# EAGLE design MQ303A + EEPROM v4.0 - para testes (EAGLE 9.6.2)
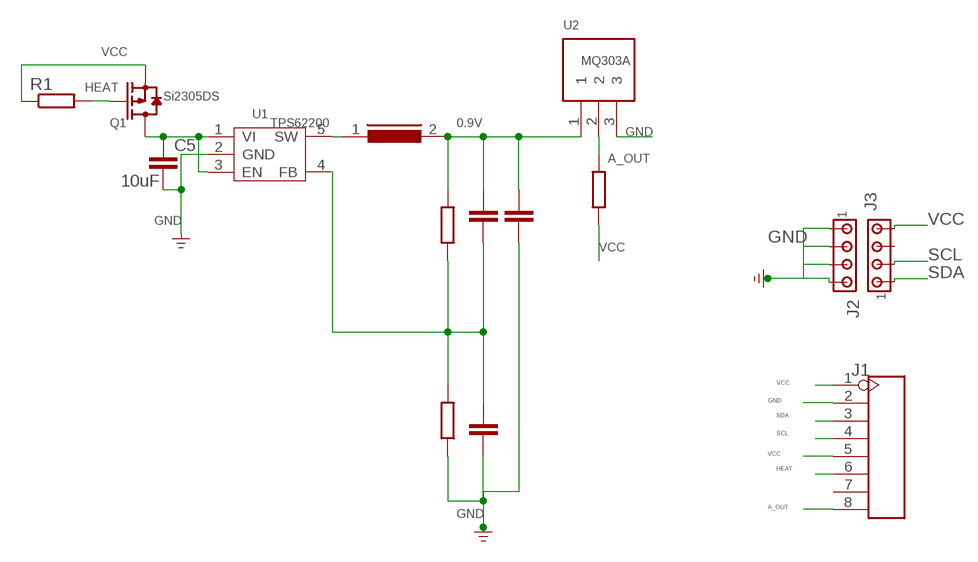
[diagram p0: schematic, sheet 1]

## Parts
C1  10uF  C-EU050-025X075  [C050-025X075]
C2  10uF  C-EU050-025X075  [C050-025X075]
C3  10uF  C-EU050-025X075  [C050-025X075]
C5  10uF  C-EU050-025X075  [C050-025X075]
J1  HEADER-8P-2.54  [8P-2.54]
J2  MTA04-100  [10X04MTA]
J3  MTA04-100  [10X04MTA]
L2  MMICC7  [MMICC7]
Q1  Si2305DS  MOSFET-P'SI2323CDS/SI2305DS<BR>'  [SOT23]
R1  R-EU_0207/10  [0207/10]
R2  R-EU_0207/10  [0207/10]
R3  R-EU_0207/10  [0207/10]
R5  R-EU_0207/10  [0207/10]
U1  TPS62200  TPS62200DBV  [SOT23-5]
U2  MQ303A  [MQ303A]

## Nets
0.9V: C1.1 C3.1 L2.2 R5.2 U2.1
A_OUT: J1.8 R3.2 U2.2
GND: C2.2 C3.2 C5.2 J1.2 J2.1 J2.2 J2.3 J2.4 R2.1 U1.2(GND) U2.3
HEAT: J1.6 Q1.1(G) R1.2
N$1: C5.1 Q1.3(D) U1.1(VI) U1.3(EN)
N$2: L2.1 U1.5(SW)
N$3: C1.2 C2.1 R2.2 R5.1 U1.4(FB)
SCL: J1.4 J3.2
SDA: J1.3 J3.1
VCC: J1.1 J1.5 J3.4 Q1.2(S) R1.1 R3.1
Unconnected: J1.7 J3.3

## Library data of the parts
C1-C3 C5 = rcl:C-EU: CAPACITOR, European symbol; SPICEPREFIX: C
J1 = Connector:HEADER-8P
J2 J3 = con-amp:MTA04-100: AMP connector
L2 = inductors:MMICC7: INDUCTOR; SPICEPREFIX: L
Q1 = Discrete:MOSFET-P
R1-R3 R5 = rcl:R-EU_: RESISTOR, European symbol; SPICEPREFIX: R
U1 = IC:TPS62200: High-Efficiency,SOT23 STEP-DOWN,DC-DC Converter
U2 = MQ303A:MQ303A

## Board
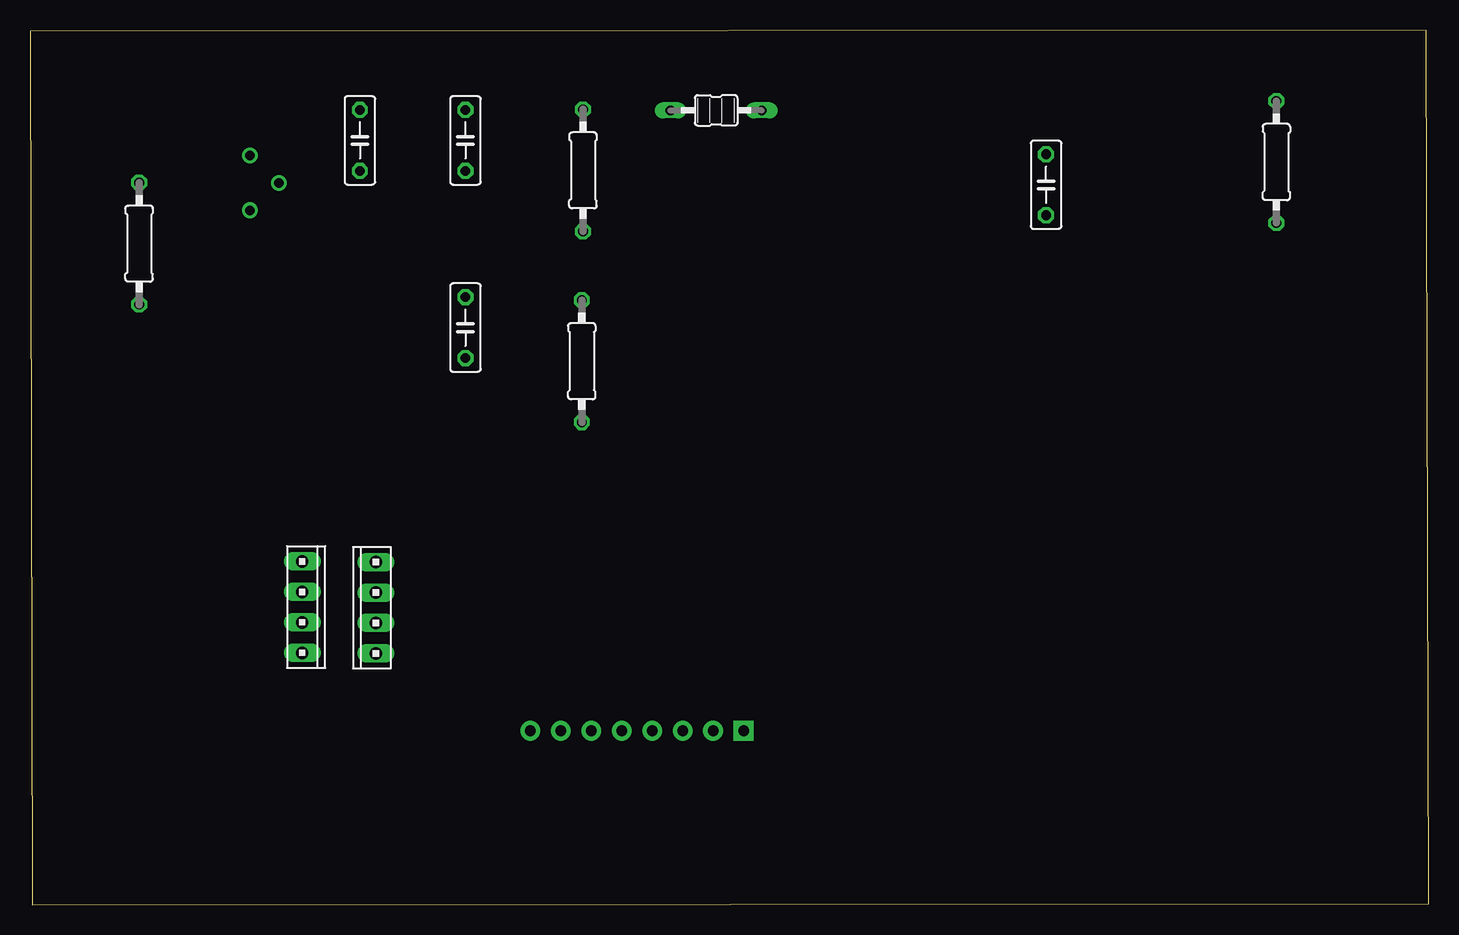
[diagram p1: board, top side]
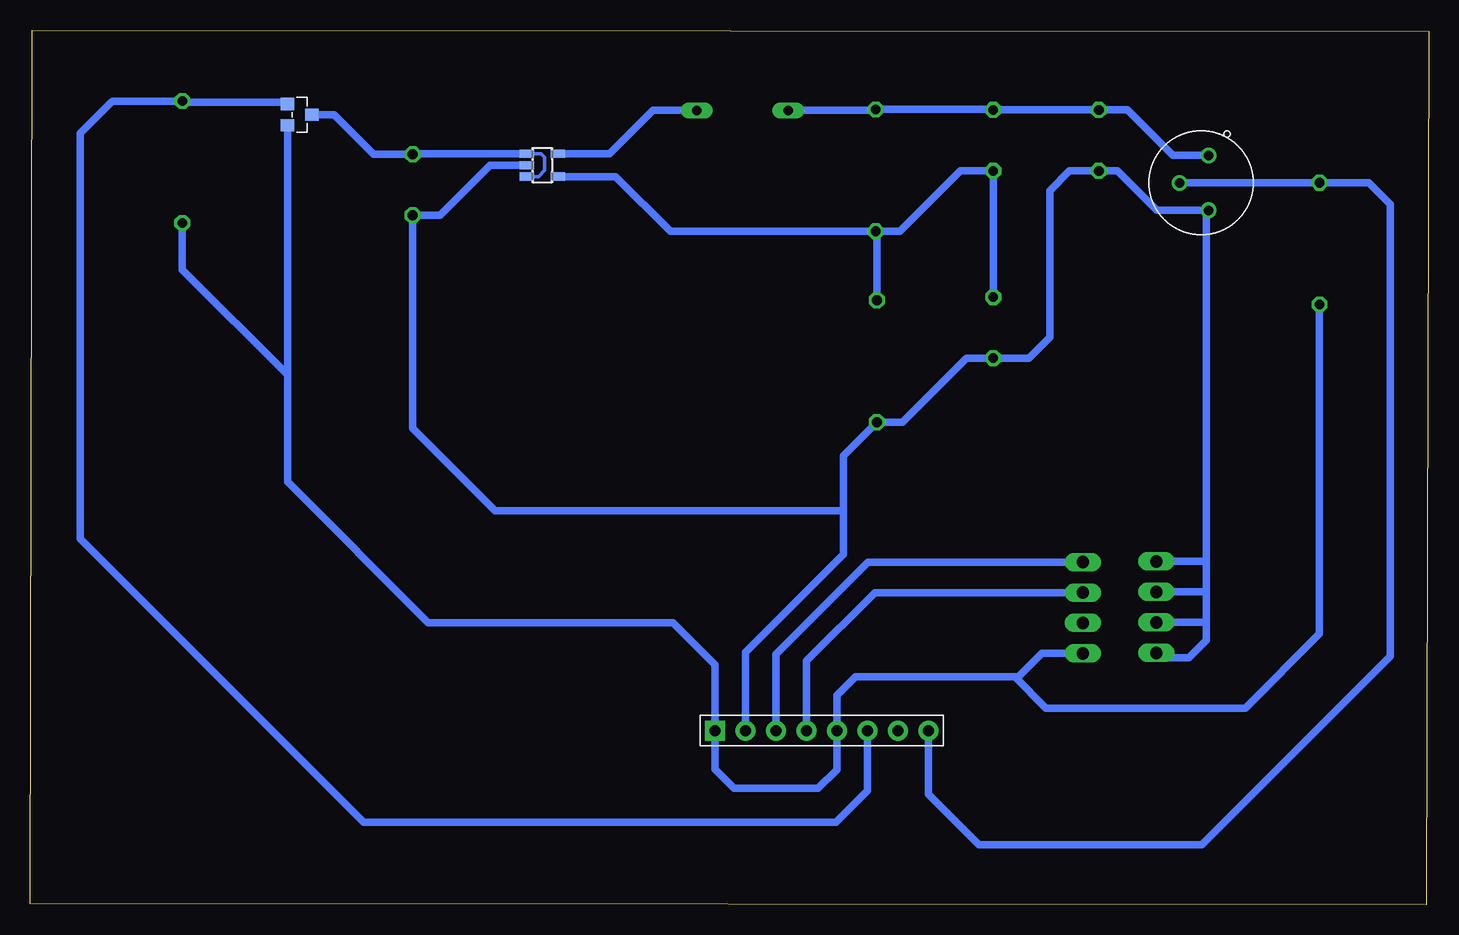
[diagram p2: board, bottom side, seen from below]

Size 116.6 x 72.9 mm. Coordinates in mm from the lower left corner, seen from the top.
Outline: 0.2,0 116.6,0.1 116.4,72.9 0,72.8 0.2,0
Copper layers (1*16): Top 0.035mm / dielectric 1.5mm / Bottom 0.035mm
Design rules "default": minimum track width 6mil, minimum drill 0.35mm, track to track 6mil, track to pad 6mil, pad to pad 6mil, via to via 6mil, smd to smd 6mil, copper to edge 40mil, drill to drill 6mil, minimum pad ring 10mil, minimum via ring 8mil, stop-mask expansion 4mil, vias tented up to drill 0mil, thermal gap 10mil

### Footprints (pad centres in the part's own frame; a part is rotated, then mirrored left to right if it is on the bottom)
C050-025X075 = drill 0.813 octagon: 1 -2.54,0; 2 2.54,0
8P-2.54 = drill 0.889 pad 1.651 square: 1 0,8.89 | drill 0.889 pad 1.651: 2 0,6.35; 3 0,3.81; 4 0,1.27; 5 0,-1.27; 6 0,-3.81; 7 0,-6.35; 8 0,-8.89
10X04MTA = drill 1.016 long: 1 3.81,0; 2 1.27,0; 3 -1.27,0; 4 -3.81,0
MMICC7 = drill 0.813 long: 1 -3.81,0; 2 3.81,0
SOT23 = smd 1.016 x 1.143: 1 -0.889,-1.016; 2 0.889,-1.016; 3 0,1.016
0207/10 = drill 0.813 octagon: 1 -5.08,0; 2 5.08,0
SOT23-5 = smd 0.69 x 1.2: 1 -0.95,-1.3; 2 0,-1.3; 3 0.95,-1.3; 4 0.95,1.3; 5 -0.95,1.3
MQ303A = drill 0.8: 1 -2.286,0.635; 2 0,-1.778; 3 2.286,0.635

### Placement (x,y rotation side)
C1  36.3,63.7 270 top
C2  36.3,48.1 270 top
C3  27.5,63.7 270 top
C5  84.7,60 270 top
J1  50.6,14.51 90 bottom
J2  22.7,24.8 270 top
J3  28.83,24.75 90 top
L2  57.2,66.2 180 top
Q1  94.12,65.84 270 bottom
R1  103.9,61.9 90 top
R2  46,45.3 90 top
R3  9.1,55.1 90 top
R5  46.1,61.2 90 top
U1  73.89,61.63 270 bottom
U2  18.98,60.16 270 bottom

### Tracks (layer width: path | path; a pad name or v marks a point on that pad's centre or on a via)
0.9V
  Bottom 0.61: L2.2 46.18,66.2 R5.2 36.34,66.28 C1.1 27.7,66.24 C3.1 25.14,66.24 21.35,62.45 U2.1
A_OUT
  Bottom 0.61: J1.8 41.71,9.21 37.5,5 18.9,5 3.2,20.7 3.2,58.38 5,60.18 R3.2 20.74,60.18 U2.2
GND
  Bottom 0.152: 18.58,23.53 18.55,23.5 | 18.68,26.07 18.55,26.2 | 18.63,28.61 18.55,28.7
  Bottom 0.61: J1.2 56.95,21.05 48.8,29.2 48.8,32.75 | 48.8,32.75 48.9,32.85 77.85,32.85 84.7,39.7 C5.2 82.4,57.46 78.23,61.63 U1.2 | J2.1 22.3,20.59 20.01,20.59 18.55,22.05 18.55,23.5 18.55,26.2 18.55,28.7 18.55,57.67 U2.3 22.67,57.87 25.96,61.16 C3.2 29.94,61.16 31.6,59.5 31.6,47.3 33.34,45.56 C2.2 38.54,45.56 43.88,40.22 R2.1 48.8,37.42 48.8,32.75 | J2.2 18.58,23.53 | J2.3 18.68,26.07 | J2.4 18.63,28.61
HEAT
  Bottom 0.152: 109.83,66.87 109.72,66.98 | 95.29,66.88 Q1.1
  Bottom 0.61: 95.28,66.87 Q1.1 | 109.83,66.87 112.4,64.3 112.4,30.5 88.8,6.9 49.4,6.9 46.79,9.51 J1.6 | 109.72,66.98 R1.2 103.8,66.88 95.29,66.88
N$1
  Bottom 0.305: U1.3 74.22,60.68 73.7,61.2 73.7,62.3 74,62.6 75.17,62.6 U1.1
  Bottom 0.61: U1.1 84.66,62.58 C5.1 87.94,62.54 91.24,65.84 Q1.3
N$2
  Bottom 0.61: L2.1 64.67,66.2 68.29,62.58 U1.5
N$3
  Bottom 0.61: C2.1 C1.2 39.04,61.16 44.08,56.12 R5.1 | R2.2 46,56.02 R5.1 | R5.1 63.22,56.12 67.78,60.68 U1.4
SCL
  Bottom 0.61: J1.4 51.87,20.33 46.17,26.02 J3.2
SDA
  Bottom 0.152: 34,28.6 33.97,28.56
  Bottom 0.61: J1.3 54.41,20.89 46.73,28.56 J3.1 33.97,28.56
VCC
  Bottom 0.61: 95.14,63.76 Q1.2 95.14,48.06 95.14,44.16 | 34.5,19 31.9,16.4 15.3,16.4 9.13,22.57 9.13,49.99 R3.1 | 95.14,44.16 95.14,35.24 83.4,23.5 63,23.5 59.49,19.99 J1.1 59.49,11.29 57.9,9.7 50.9,9.7 49.33,11.27 J1.5 49.33,17.47 47.8,19 34.5,19 | 34.5,19 34.2,19 32.26,20.95 J3.4 | R1.1 103.9,52.92 95.14,44.16